# EAGLE schematic PIC32board (EAGLE 8.1.0)
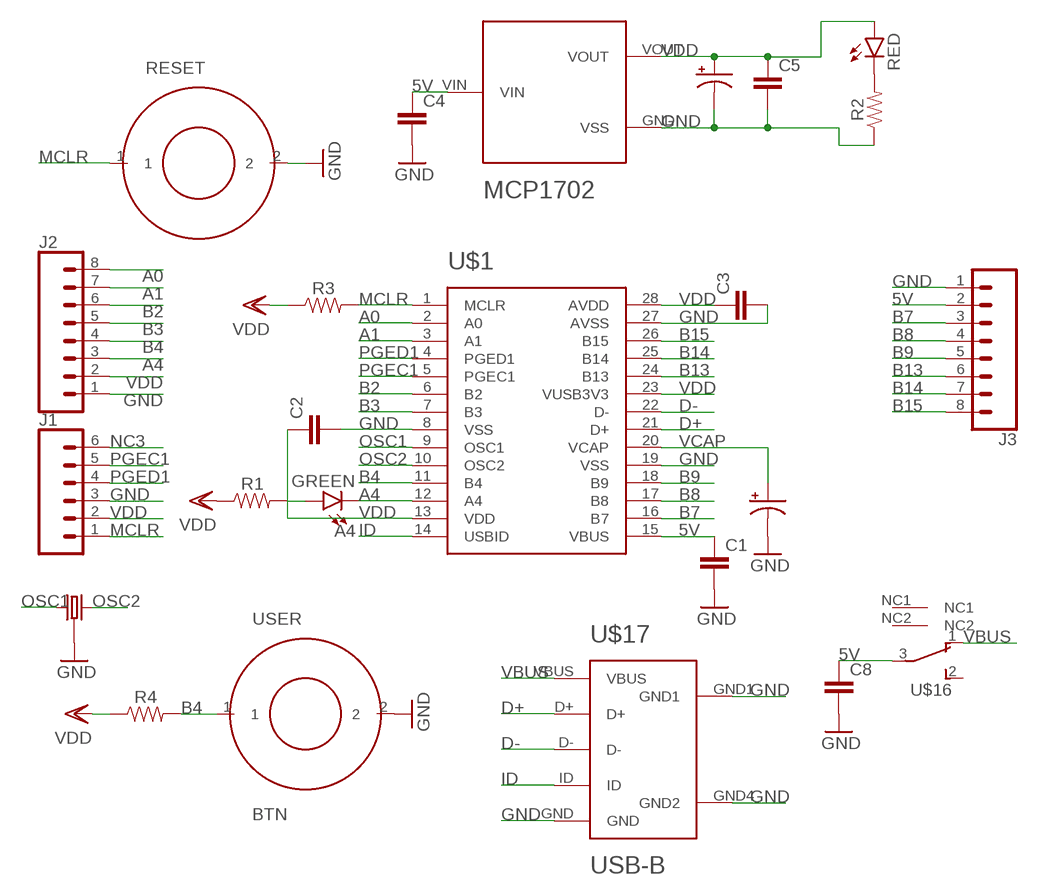
[diagram p0: schematic, sheet 1]

## Parts
A4  GREEN  LED-GREEN0603  [LED-0603]
C1  0.1µF-SMD  [0603]
C2  0.1µF-SMD  [0603]
C3  0.1µF-SMD  [0603]
C4  0.1µF-SMD  [0603]
C5  0.1µF-SMD  [0603]
C6  10µF-POL  [10µF_THROUGHHOLE]
C7  10µF-POL  [10µF_THROUGHHOLE]
C8  0.1µF-SMD  [0603]
J1  CONN_06SILK_FEMALE_PTH  [1X06]
J2  CONN_08"  [1X08]
J3  CONN_08"  [1X08]
PWR  RED  LED-RED0603  [LED-0603]
R1  330  330OHM-0603-1/10W-1%  [0603]
R2  330  330OHM-0603-1/10W-1%  [0603]
R3  10KOHM-SMD  [0603]
R4  10KOHM-SMD  [0603]
RESET  BTN  [BTN]
U$1  PIC32MX250F128B_SOCKET  [DIP28]
U$2  MCP1702  [TO92]
U$8  8MHZ-CRYSTAL  [8MHZ-CRYSTAL]
U$16  SLIDE-SWITCH  [SLIDE-SWITCH]
U$17  USB-B  [USB-MINIB-THM-MOLEX]
USER  BTN  [BTN]

## Nets
5V: C1.1 C4.1 C8.1 J3.2 U$1.15(VBUS) U$2.VIN U$16.3
A0: J2.8 U$1.2(A0)
A1: J2.7 U$1.3(A1)
A4: A4.C J2.3 U$1.12(A4)
B2: J2.6 U$1.6(B2)
B3: J2.5 U$1.7(B3)
B4: J2.4 R4.2 U$1.11(B4) USER.1
B7: J3.3 U$1.16(B7)
B8: J3.4 U$1.17(B8)
B9: J3.5 U$1.18(B9)
B13: J3.6 U$1.24(B13)
B14: J3.7 U$1.25(B14)
B15: J3.8 U$1.26(B15)
D+: U$1.21(D+) U$17.D+
D-: U$1.22(D-) U$17.D-
GND: C1.2 C2.2 C3.2 C4.2 C5.2 C6.NEG(-) C7.NEG(-) C8.2 J1.3 J2.1 J3.1 R2.1 RESET.2 U$1.8(VSS) U$1.19(VSS) U$1.27(AVSS) U$2.GND(VSS) U$8.2(VSS) U$17.GND U$17.GND1 U$17.GND4(GND2) USER.2
ID: U$1.14(USBID) U$17.ID
MCLR: J1.1 R3.2 RESET.1 U$1.1(MCLR)
N$1: PWR.C R2.2
N$2: A4.A R1.2
NC3: J1.6
OSC1: U$1.9(OSC1) U$8.1
OSC2: U$1.10(OSC2) U$8.3
PGEC1: J1.5 U$1.5(PGEC1)
PGED1: J1.4 U$1.4(PGED1)
VBUS: U$16.1 U$17.VBUS
VCAP: C7.POS(+) U$1.20(VCAP)
VDD: C2.1 C3.1 C5.1 C6.POS(+) J1.2 J2.2 PWR.A R1.1 R3.1 R4.1 U$1.13(VDD) U$1.23(VUSB3V3) U$1.28(AVDD) U$2.VOUT
Unconnected: U$16.2 U$16.NC1 U$16.NC2

## Library data of the parts
A4 = me433:LED-GREEN: Green SMD LED Used in manufacturing of various products at SparkFun Packages: 0603 - SMD 0603 package [Product Link] <http://www.futureelectronics.com/en/technologies/semiconductors/optoelectronics/leds/Pages/9894312-LTST-C190GKT.aspx?CrossPart=HSMG-C190&IM=0> LilyPad 1206 - SMD1206 LilyPad package [Product Link] <http://www.futureelectronics.com/en/Technologies/Product.aspx?ProductID=IN150NGHARVATEKCORPORATION2049943&IM=0> 1206 - SMD1206 package [Product Link] <http://www.futureelectronics.com/en/technologies/semiconductors/optoelectronics/leds/Pages/8315665-LTST-C150KGKT.aspx?IM=0> 1206 Bottom Mount -SMD 1206 Bottom Mount [Product Link] <http://www.digikey.com/product-detail/en/lite-on-inc/LTST-C230KGKT/160-1456-1-ND/386854> SparkFun Products: Pro Mini 328 -5V <https://www.sparkfun.com/products/821> RedBoard <https://www.sparkfun.com/products/12757> MP3 Trigger <https://www.sparkfun.com/products/13720> Makey Makey <https://www.sparkfun.com/products/11076>; PROD_ID: DIO-00821
C1-C5 C8 = me433:0.1µF-SMD
C6 C7 = me433:10µF-POL
J1 = me433:CONN_06: Multi connection point. Often used as Generic Header-pin footprint for 0.1 inch spaced/style header connections On any of the 0.1 inch spaced packages, you can populate with these: Break Away Headers - Straight <https://www.sparkfun.com/products/116> (PRT-00116) Break Away Male Headers - Right Angle <https://www.sparkfun.com/products/553> (PRT-00553) Female Headers <https://www.sparkfun.com/products/115> (PRT-00115) Break Away Headers - Machine Pin <https://www.sparkfun.com/products/117> (PRT-00117) Break Away Female Headers - Swiss Machine Pin <https://www.sparkfun.com/products/743> (PRT-00743) Arduino Stackable Header - 6 Pin <https://www.sparkfun.com/products/9280> (PRT-09280) For SCREWTERMINALS and SPRING TERMINALS visit here: Screw Terimnals on SparkFun.com <https://www.sparkfun.com/search/results?term=Screw+Terminals> (5mm/3.5mm/2.54mm spacing) This device is also useful as a general connection point to wire up your design to another part of your project. Our various solder wires solder well into these plated through hole pads. Hook-Up Wire - Assortment (Stranded, 22 AWG) <https://www.sparkfun.com/products/11375> (PRT-11375) Hook-Up Wire - Assortment (Solid Core, 22 AWG) <https://www.sparkfun.com/products/11367> (PRT-11367) View the entire wire category on our website here <https://www.sparkfun.com/categories/141>; PROD_ID: CONN-08437
J2 J3 = me433:CONN_08: Multi connection point. Often used as Generic Header-pin footprint for 0.1 inch spaced/style header connections On any of the 0.1 inch spaced packages, you can populate with these: Break Away Headers - Straight <https://www.sparkfun.com/products/116> (PRT-00116) Break Away Male Headers - Right Angle <https://www.sparkfun.com/products/553> (PRT-00553) Female Headers <https://www.sparkfun.com/products/115> (PRT-00115) Break Away Headers - Machine Pin <https://www.sparkfun.com/products/117> (PRT-00117) Break Away Female Headers - Swiss Machine Pin <https://www.sparkfun.com/products/743> (PRT-00743) Arduino Stackable Header - 8 Pin <https://www.sparkfun.com/products/9279> (PRT-09279) For SCREWTERMINALS and SPRING TERMINALS visit here: Screw Terimnals on SparkFun.com <https://www.sparkfun.com/search/results?term=Screw+Terminals> (5mm/3.5mm/2.54mm spacing) This device is also useful as a general connection point to wire up your design to another part of your project. Our various solder wires solder well into these plated through hole pads. Hook-Up Wire - Assortment (Stranded, 22 AWG) <https://www.sparkfun.com/products/11375> (PRT-11375) Hook-Up Wire - Assortment (Solid Core, 22 AWG) <https://www.sparkfun.com/products/11367> (PRT-11367) View the entire wire category on our website here <https://www.sparkfun.com/categories/141> Special notes: Molex polarized connector foot print use with SKU : PRT-08231 with associated crimp pins and housings. 1MM SMD Version SKU: PRT-10208 NOTES ON THE VARIANTS LOCK and LOCK_LONGPADS... This footprint was designed to help hold the alignment of a through-hole component (i.e. 6-pin header) while soldering it into place. You may notice that each hole has been shifted either up or down by 0.005 of an inch from it's more standard position (which is a perfectly straight line). This slight alteration caused the pins (the squares in the middle) to touch the edges of the holes. Because they are alternating, it causes a "brace" to hold the component in place. 0.005 has proven to be the perfect amount of "off-center" position when using our standard breakaway headers. Although looks a little odd when you look at the bare footprint, once you have a header in there, the alteration is very hard to notice. Also,if you push a header all the way into place, it is covered up entirely on the bottom side.; PROD_ID: CONN-08438
PWR = me433:LED-RED: Red SMD LED Used in manufacturing of most products at SparkFun Packages: 0603 - SMD 0603 package [Product Link] <http://docs.avagotech.com/docs/AV02-0551EN> 0603 SMART - SMD 0603 SMART package ( more efficient and expensive)[Product Link] <http://www.osram-os.com/Graphics/XPic2/00077099_0.pdf> 1206 - SMD1206 package [Product Link] <https://www.sparkfun.com/datasheets/DevTools/LilyPad/Q150OVS4.pdff> SparkFun Products: Pro Mini 328 -5V <https://www.sparkfun.com/products/821> RedBoard <https://www.sparkfun.com/products/12757> IOIO-OTG <https://www.sparkfun.com/products/13613>; PROD_ID: DIO-00819
R1 R2 = me433:330OHM: 330Ω resistor A resistor is a passive two-terminal electrical component that implements electrical resistance as a circuit element. Resistors act to reduce current flow, and, at the same time, act to lower voltage levels within circuits. - Wikipedia; PROD_ID: RES-00818
R3 R4 = me433:10KOHM-SMD
RESET USER = me433:BTN
U$1 = me433:PIC32MX250F128B_SOCKET
U$2 = me433:MCP1702
U$8 = me433:8MHZ-CRYSTAL
U$16 = me433:SLIDE-SWITCH
U$17 = me433:USB-B